# Altium schematic sheet Sheet2.SchDoc
size A; SheetNumber: 1; SheetTotal: 1
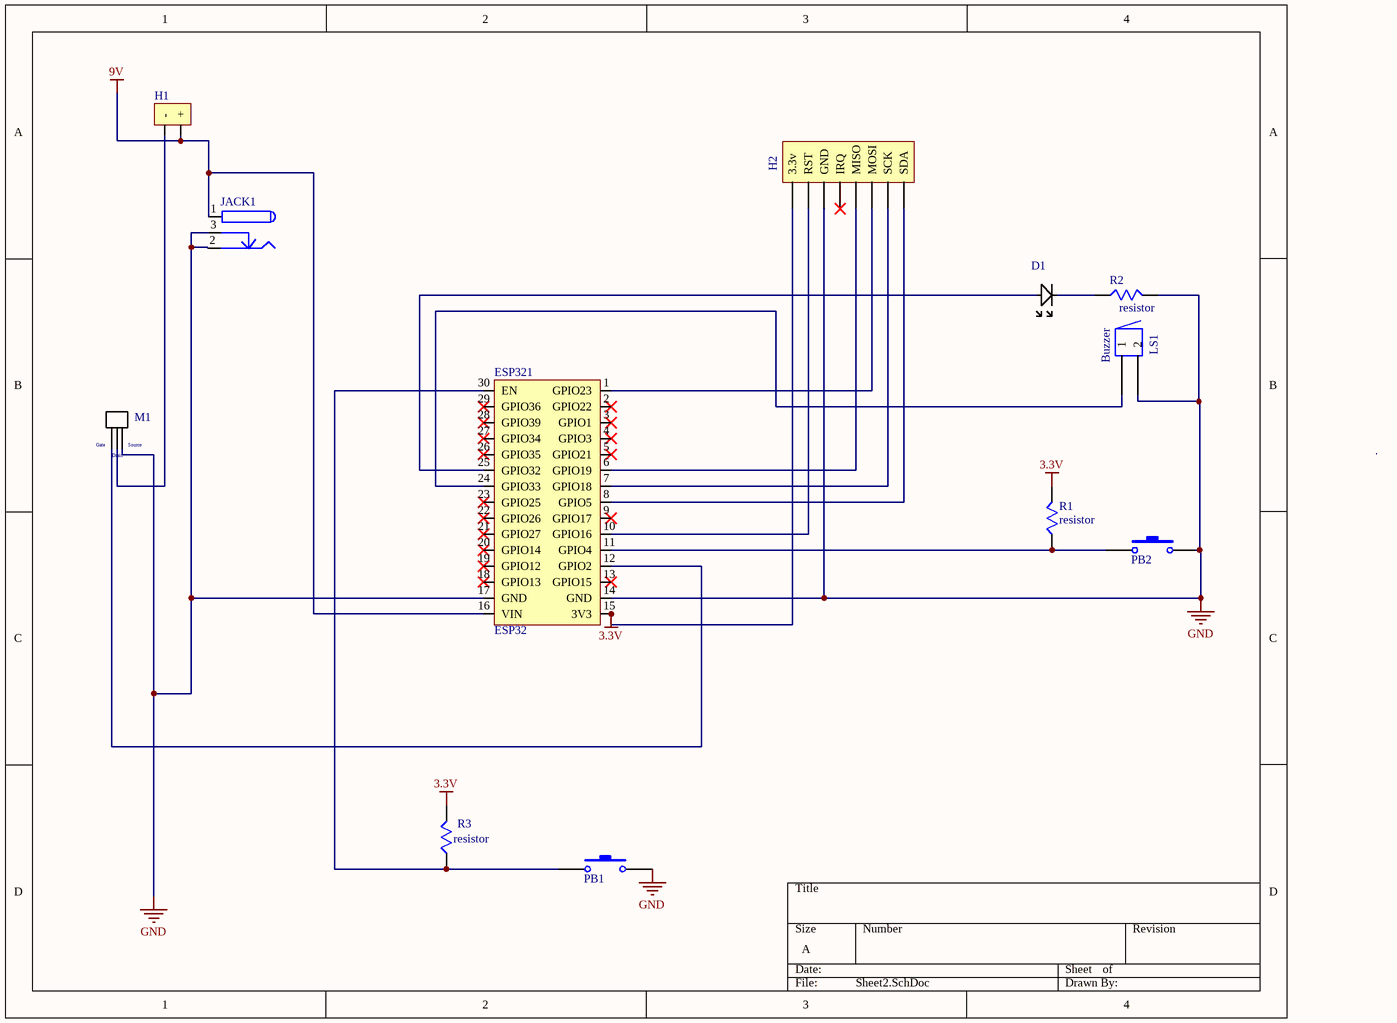
[diagram p0: Sheet2.SchDoc]

## Parts
D1  LED  [LED]  (value not drawn)
ESP321  ESP32  [ESP32 NodeMCU]
H1  PinHeader2  [Header x2]  (value not drawn)
H2  Header 8  [Header 8X1]  (value not drawn)
JACK1  PWR2.5  [Power Jack]  (value not drawn)
LS1  Buzzer  [Buzzer]
M1  Mosfet  [Mosfet]  (value not drawn)
PB1  PUSH BUTTON  [push button]  (value not drawn)
PB2  PUSH BUTTON  [push button]  (value not drawn)
R1  resistor  [Resistor]
R2  resistor  [Resistor]
R3  resistor  [Resistor]

## Nets
3.3V: ESP321.15(3V3) H2.1(3.3v) R1.2 R3.2
9V: ESP321.16(VIN) H1.2(+) JACK1.1
GND: ESP321.14(GND) ESP321.17(GND) H2.3(GND) JACK1.2 JACK1.3 LS1.2 M1.3 PB1.2 PB2.2 R2.2
NetD1_1: D1.1 R2.1
NetD1_2: D1.2 ESP321.25(GPIO32)
NetESP321_1: ESP321.1(GPIO23) H2.6(MOSI)
NetESP321_6: ESP321.6(GPIO19) H2.5(MISO)
NetESP321_7: ESP321.7(GPIO18) H2.7(SCK)
NetESP321_8: ESP321.8(GPIO5) H2.8(SDA)
NetESP321_10: ESP321.10(GPIO16) H2.2(RST)
NetESP321_11: ESP321.11(GPIO4) PB2.1 R1.1
NetESP321_12: ESP321.12(GPIO2) M1.1
NetESP321_24: ESP321.24(GPIO33) LS1.1
NetESP321_30: ESP321.30(EN) PB1.1 R3.1
NetH1_1: H1.1(-) M1.2

Not connected (* = marked no-connect by the designer): ESP321 2(GPIO22)* 3(GPIO1)* 4(GPIO3)* 5(GPIO21)* 9(GPIO17)* 13(GPIO15)* 18(GPIO13)* 19(GPIO12)* 20(GPIO14)* 21(GPIO27)* 22(GPIO26)* 23(GPIO25)* 26(GPIO35)* 27(GPIO34)* 28(GPIO39)* 29(GPIO36)*; H2 4(IRQ)*

## Notes on the sheet
- (in symbol Mosfet) Gate; Source; Drain

## Library data of the parts
ESP321 = ESP32_DEVKIT
H2 = Header 8: Header, 8-Pin; LatestRevisionDate: 17-Jul-2002; LatestRevisionNote: Re-released for DXP Platform.; Publisher: Altium Limited
JACK1 = PWR2.5: Low Voltage Power Supply Connector; Published: 17-Dec-2003; DatasheetDocument: 09-May-2002; Publisher: Altium Limited; ComponentLink1Description: Manufacturer Link; ComponentLink1URL: http://domino.kycon.com/internet/Products.html
LS1 = Buzzer: Magnetic Transducer Buzzer; Published: 24-Mar-1999; LatestRevisionDate: 17-Dec-2003; LatestRevisionNote: Schematic revised, PCB Footprint replaced.; DatasheetDocument: 17-Dec-2003; PackageReference: ABSM-1574; Publisher: Altium Limited; ComponentLink1Description: Manufacturer Link; ComponentLink1URL: http://www.megastar.com/linecard/buzzmode/index.php
PB1 PB2 = PUSH BUTTON: Switch; Published: 24-Mar-1999; LatestRevisionDate: 17-Jul-2002; LatestRevisionNote: Re-released for DXP Platform.; PackageReference: SPST-2; Publisher: Altium Limited
R1-R3 = Resistor 0805: VISHAY - CRCW08050000Z0EA - SMD Chip Resistor, Jumper, 0805 [2012 Metric], 0 ohm, CRCW e3 Series, 150 V, Thick Film, 125 mW; Resistance: 0mR; Power Rating: 125mW; Voltage Rating: 150V; Tolerance: 1%; Temperature Coefficient: 100ppm/°C; Supplier 1: Digi-Key; Manufacturer: Vishay; Manufacturer Part Number: CRCW08050000Z0EA; RoHS: Yes; Category: Chip SMD Resistors; Stock 1: 587199; Pricing 1: 1=0/10000, 10=0/03600, 25=0/02640, 50=0/02000, 100=0/01480, 250=0/01124, 500=0/00900, 1000=0/00663 (USD); Case/Package: 0805; Weight: 0.000194oz; Case Code (Imperial): 0805; Case Code (Metric): 2012; Contact Plating: Tin,Lead; Min Operating Temperature: -55°C; Max Operating Temperature: 155°C; Resistor Type: Thick Film; Packaging: Tape and Reel; Termination: SMD/SMT; Voltage Rating (DC): 150V; Package Quantity: 1; Number of Terminations: 2; Max Power Dissipation: 125mW; Features: Automotive AEC-Q200; Length: 2mm; Height: 0.45mm; Width: 1.25mm; Depth: 1.25mm; Radiation Hardening: No; REACH SVHC: Unknown; Military Standard: Not; Lead Free: Lead Free; Supplier Part Number 1: 541-0.0ACT-ND